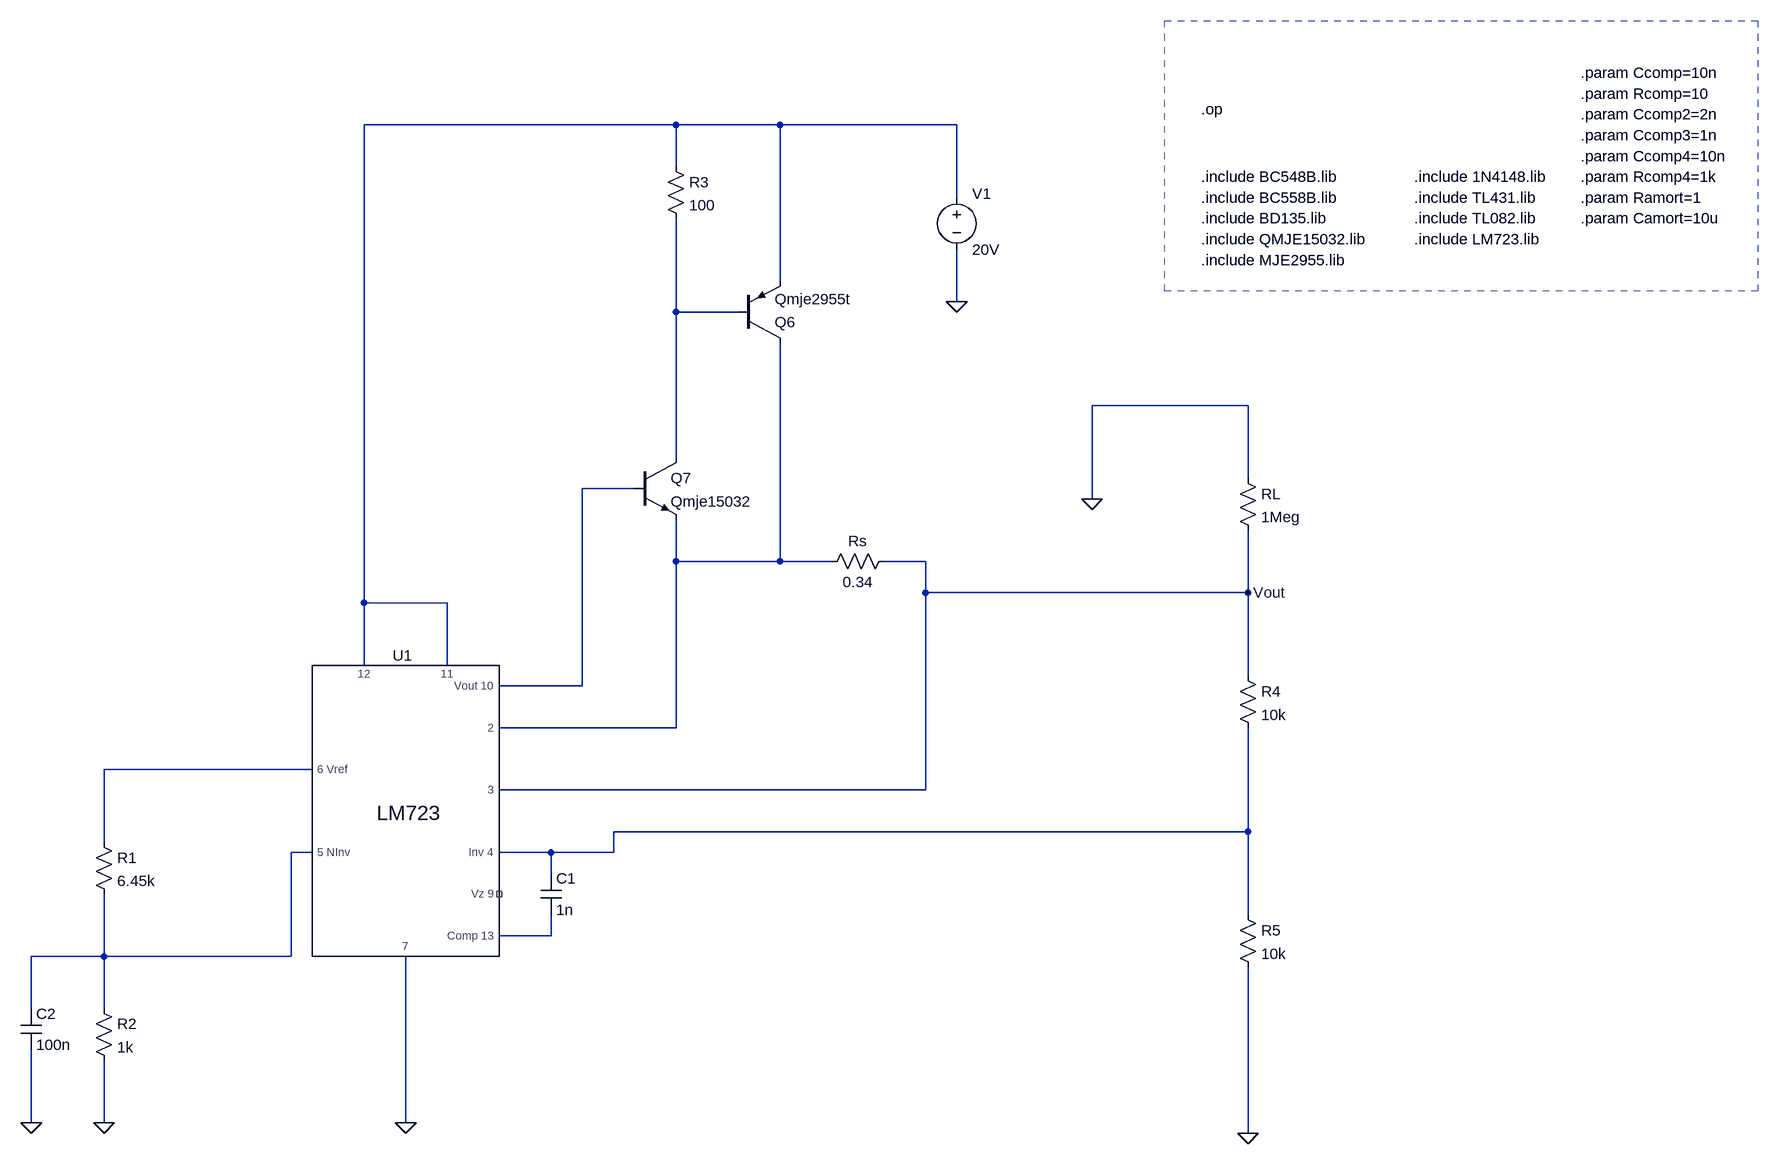
[diagram p0: schematic power_supply_P21.asc]
power_supply_P21.asc, the LTspice schematic file:
Version 4
SHEET 1 3396 1396
WIRE 1248 -384 768 -384
WIRE 1408 -384 1248 -384
WIRE 1680 -384 1408 -384
WIRE 1248 -320 1248 -384
WIRE 1680 -272 1680 -384
WIRE 1408 -144 1408 -384
WIRE 1680 -112 1680 -192
WIRE 1248 -96 1248 -240
WIRE 1344 -96 1248 -96
WIRE 2128 48 1888 48
WIRE 1248 128 1248 -96
WIRE 2128 160 2128 48
WIRE 1184 176 1104 176
WIRE 1888 192 1888 48
WIRE 1248 288 1248 224
WIRE 1408 288 1408 -48
WIRE 1408 288 1248 288
WIRE 1488 288 1408 288
WIRE 1632 288 1568 288
WIRE 1632 336 1632 288
WIRE 2128 336 2128 240
WIRE 2128 336 1632 336
WIRE 768 352 768 -384
WIRE 896 352 768 352
WIRE 768 448 768 352
WIRE 896 448 896 352
WIRE 2128 464 2128 336
WIRE 1104 480 1104 176
WIRE 1104 480 976 480
WIRE 1248 544 1248 288
WIRE 1248 544 976 544
WIRE 688 608 368 608
WIRE 1632 640 1632 336
WIRE 1632 640 976 640
WIRE 2128 704 2128 544
WIRE 2128 704 1152 704
WIRE 368 720 368 608
WIRE 688 736 656 736
WIRE 1056 736 976 736
WIRE 1152 736 1152 704
WIRE 1152 736 1056 736
WIRE 1056 768 1056 736
WIRE 2128 832 2128 704
WIRE 1056 864 1056 832
WIRE 1056 864 976 864
WIRE 368 896 368 800
WIRE 368 896 256 896
WIRE 656 896 656 736
WIRE 656 896 368 896
WIRE 256 976 256 896
WIRE 368 976 368 896
WIRE 256 1152 256 1040
WIRE 368 1152 368 1056
WIRE 832 1152 832 896
WIRE 2128 1168 2128 912
FLAG 1680 -112 0
FLAG 832 1152 0
FLAG 2128 1168 0
FLAG 1888 192 0
FLAG 2128 336 Vout
FLAG 368 1152 0
FLAG 256 1152 0
DATAFLAG 480 896 ""
DATAFLAG 2016 336 ""
DATAFLAG 576 608 ""
DATAFLAG 1328 704 ""
SYMBOL LM723 832 576 R0
SYMATTR InstName U1
SYMBOL cap 1040 768 R0
SYMATTR InstName C1
SYMATTR Value 1n
SYMATTR SpiceLine Rser=100
SYMBOL voltage 1680 -288 R0
WINDOW 123 0 0 Left 2
WINDOW 0 24 10 Left 2
SYMATTR InstName V1
SYMATTR Value 20V
SYMATTR SpiceLine Rser=0
SYMBOL res 1584 272 R90
WINDOW 0 0 56 VBottom 2
WINDOW 3 32 56 VTop 2
SYMATTR InstName Rs
SYMATTR Value 0.34
SYMBOL pnp 1344 -48 M180
SYMATTR InstName Q6
SYMATTR Value Qmje2955t
SYMBOL res 1232 -336 R0
SYMATTR InstName R3
SYMATTR Value 100
SYMBOL npn 1184 128 R0
SYMATTR InstName Q7
SYMATTR Value Qmje15032
SYMBOL res 2112 816 R0
SYMATTR InstName R5
SYMATTR Value 10k
SYMBOL res 2112 144 R0
SYMATTR InstName RL
SYMATTR Value 1Meg
SYMBOL res 2112 448 R0
SYMATTR InstName R4
SYMATTR Value 10k
SYMBOL res 352 960 R0
SYMATTR InstName R2
SYMATTR Value 1k
SYMBOL res 352 704 R0
SYMATTR InstName R1
SYMATTR Value 6.45k
SYMBOL cap 240 976 R0
SYMATTR InstName C2
SYMATTR Value 100n
SYMATTR SpiceLine Rser=100
TEXT 2056 -272 Left 2 !.include BC558B.lib
TEXT 2384 -240 Left 2 !.include TL082.lib
TEXT 2056 -304 Left 2 !.include BC548B.lib
TEXT 2056 -176 Left 2 !.include MJE2955.lib
TEXT 2056 -240 Left 2 !.include BD135.lib
TEXT 2384 -304 Left 2 !.include 1N4148.lib
TEXT 2384 -272 Left 2 !.include TL431.lib
TEXT 2056 -208 Left 2 !.include QMJE15032.lib
TEXT 2056 -408 Left 2 !.op
TEXT 2640 -464 Left 2 !.param Ccomp=10n
TEXT 2640 -432 Left 2 !.param Rcomp=10
TEXT 2640 -400 Left 2 !.param Ccomp2=2n
TEXT 2640 -368 Left 2 !.param Ccomp3=1n
TEXT 2640 -336 Left 2 !.param Ccomp4=10n
TEXT 2640 -272 Left 2 !.param Ramort=1
TEXT 2640 -240 Left 2 !.param Camort=10u
TEXT 2640 -304 Left 2 !.param Rcomp4=1k
TEXT 2384 -208 Left 2 !.include LM723.lib
RECTANGLE Normal 2912 -128 2000 -544 1

The netlist it stands for:
* power_supply_P21.asc
XU1 N004 Vout N006 N007 N005 0 NC_01 N003 N001 N001 N008 LM723  ; pins 2 3 Inv_4 5_NInv 6_Vref 7 Vz_9 Vout_10 11 12 Comp_13
C1 N006 N008 1n Rser=100
V1 N001 0 20V Rser=0
Rs Vout N004 0.34
Q6 N004 N002 N001 0 Qmje2955t
R3 N001 N002 100
Q7 N002 N003 N004 0 Qmje15032
R5 N006 0 10k
RL 0 Vout 1Meg
R4 Vout N006 10k
R2 N007 0 1k
R1 N005 N007 6.45k
C2 N007 0 100n Rser=100
.model NPN NPN
.model PNP PNP
.lib standard.bjt
.include BC558B.lib
.include TL082.lib
.include BC548B.lib
.include MJE2955.lib
.include BD135.lib
.include 1N4148.lib
.include TL431.lib
.include QMJE15032.lib
.op
.param Ccomp=10n
.param Rcomp=10
.param Ccomp2=2n
.param Ccomp3=1n
.param Ccomp4=10n
.param Ramort=1
.param Camort=10u
.param Rcomp4=1k
.include LM723.lib
.backanno
.end